# Altium project uavDataModule.PrjPcb
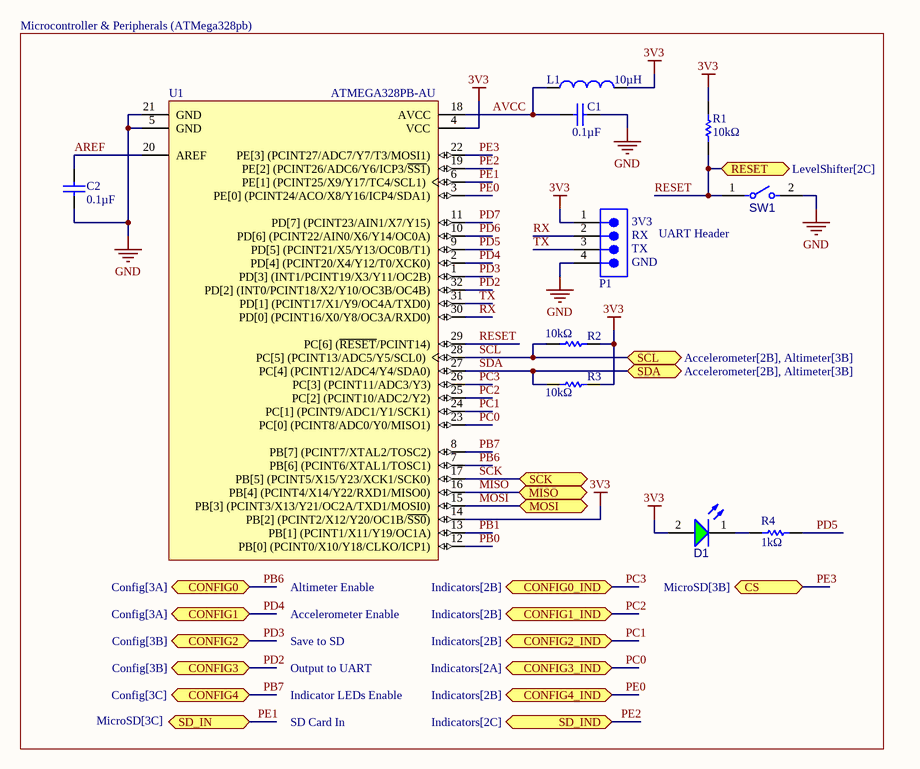
[diagram p0: Microcontroller.SchDoc]
8 sheets, 52 parts. Net scope: flat (ports and power ports of the same name join across sheets).
Board file: Main.PcbDoc
Sheets:
  Microcontroller.SchDoc
  Altimeter.SchDoc
  Accelerometer.SchDoc
  MicroSD.SchDoc
  Power.SchDoc
  LevelShifter.SchDoc
  Config.SchDoc
  Indicators.SchDoc

## Sheet Microcontroller.SchDoc
size A; SheetNumber: 1; SheetTotal: 8

### Parts
C1  0.1µF  [CAPC3216X100X50LL20T25]
C2  0.1µF  [CAPC3216X100X50LL20T25]
D1  150120GS75000  [WL-SMCW_1206_150120xx75000]  (value not drawn)
L1  10µH  [WE-MI_1206_L3.2W1.6H1.1]
P1  61300411121  [61300411121]  (value not drawn)
R1  10kΩ  [RESC3116X65X40LL10T20]
R2  10kΩ  [RESC3116X65X40LL10T20]
R3  10kΩ  [RESC3116X65X40LL10T20]
R4  1kΩ  [RESC3116X65X40LL10T20]
SW1  RST  [FP-B3U-1000P-B-MFG]  (value not drawn)
U1  ATMEGA328PB-AU  [ATML-32A_L]

### Ports
CONFIG0 (bidir, see Config[3A]), CONFIG0_IND (bidir, see Indicators[2B]), CONFIG1 (bidir, see Config[3A]), CONFIG1_IND (bidir, see Indicators[2B]), CONFIG2 (bidir, see Config[3B]), CONFIG2_IND (bidir, see Indicators[2B]), CONFIG3 (bidir, see Config[3B]), CONFIG3_IND (bidir, see Indicators[2A]), CONFIG4 (bidir, see Config[3C]), CONFIG4_IND (bidir, see Indicators[2B]), CS (bidir, see MicroSD[3B]), MISO (bidir, see LevelShifter[4C], MicroSD[3B]), MOSI (bidir, see LevelShifter[2B], MicroSD[3B]), RESET (bidir, see LevelShifter[2C]), SCK (bidir, see LevelShifter[2C], MicroSD[3B]), SCL (bidir, see Accelerometer[2B], Altimeter[3B]), SD_IN (bidir, see MicroSD[3C]), SD_IND (bidir, see Indicators[2C]), SDA (bidir, see Accelerometer[2B], Altimeter[3B])

### Nets
3V3: D1.2(A) L1.2 P1.1 R1.2 R2.2 R3.2 U1.4(VCC) U1.14(PB[2]_(PCINT2/X12/Y20/OC1B/~{SS0}))
GND: C1.1 C2.2 P1.4 SW1.2 U1.5(GND) U1.21(GND)
AREF: C2.1 U1.20(AREF)
AVCC: C1.2 L1.1 U1.18(AVCC)
MISO: U1.16(PB[4]_(PCINT4/X14/Y22/RXD1/MISO0)) ; port MISO
MOSI: U1.15(PB[3]_(PCINT3/X13/Y21/OC2A/TXD1/MOSI0)) ; port MOSI
PB0: U1.12(PB[0]_(PCINT0/X10/Y18/CLKO/ICP1))
PB1: U1.13(PB[1]_(PCINT1/X11/Y19/OC1A))
PB6: U1.7(PB[6]_(PCINT6/XTAL1/TOSC1)) ; port CONFIG0
PB7: U1.8(PB[7]_(PCINT7/XTAL2/TOSC2)) ; port CONFIG4
PC0: U1.23(PC[0]_(PCINT8/ADC0/Y0/MISO1)) ; port CONFIG3_IND
PC1: U1.24(PC[1]_(PCINT9/ADC1/Y1/SCK1)) ; port CONFIG2_IND
PC2: U1.25(PC[2]_(PCINT10/ADC2/Y2)) ; port CONFIG1_IND
PC3: U1.26(PC[3]_(PCINT11/ADC3/Y3)) ; port CONFIG0_IND
PD2: U1.32(PD[2]_(INT0/PCINT18/X2/Y10/OC3B/OC4B)) ; port CONFIG3
PD3: U1.1(PD[3]_(INT1/PCINT19/X3/Y11/OC2B)) ; port CONFIG2
PD4: U1.2(PD[4]_(PCINT20/X4/Y12/T0/XCK0)) ; port CONFIG1
PD5: R4.1 U1.9(PD[5]_(PCINT21/X5/Y13/OC0B/T1))
PD6: U1.10(PD[6]_(PCINT22/AIN0/X6/Y14/OC0A))
PD7: U1.11(PD[7]_(PCINT23/AIN1/X7/Y15))
PE0: U1.3(PE[0]_(PCINT24/ACO/X8/Y16/ICP4/SDA1)) ; port CONFIG4_IND
PE1: U1.6(PE[1]_(PCINT25/X9/Y17/TC4/SCL1)) ; port SD_IN
PE2: U1.19(PE[2]_(PCINT26/ADC6/Y6/ICP3/~{SS1})) ; port SD_IND
PE3: U1.22(PE[3]_(PCINT27/ADC7/Y7/T3/MOSI1)) ; port CS
RESET: R1.1 SW1.1 U1.29(PC[6]_(~{RESET}/PCINT14)) ; port RESET
RX: P1.2 U1.30(PD[0]_(PCINT16/X0/Y8/OC3A/RXD0))
SCK: U1.17(PB[5]_(PCINT5/X15/Y23/XCK1/SCK0)) ; port SCK
SCL: R2.1 U1.28(PC[5]_(PCINT13/ADC5/Y5/SCL0)) ; port SCL
SDA: R3.1 U1.27(PC[4]_(PCINT12/ADC4/Y4/SDA0)) ; port SDA
TX: P1.3 U1.31(PD[1]_(PCINT17/X1/Y9/OC4A/TXD0))
NetD1_1: D1.1(K) R4.2

### Notes on the sheet
- Microcontroller & Peripherals (ATMega328pb)
- (near P1) 3V3
- (near P1) TX
- (near P1) RX
- (near P1) GND
- UART Header
- (near U1) Altimeter Enable
- Accelerometer Enable
- Save to SD
- Output to UART
- Indicator LEDs Enable
- SD Card In

### Library data of the parts
C1 C2 = CMP-1664-00001-4: Chip Capacitor, 100 nF, +/- 10%, 25 V, -55 to 125 degC, 1206 (3216 Metric), RoHS, Tape and Reel; Manufacturer: Kemet; Voltage Rating: 25 V; ComponentLink1URL: http://www.kemet.com/; Max Operating Temperature: 125 degC; PackageReference: 1206; ComponentLink2URL: http://www.kemet.com/docfinder?Partnumber=C1206F104K3RACTU; ComponentLink1Description: Manufacturer URL; ComponentLink2Description: Datasheet; Length: 3.2 mm; Packaging: Tape and Reel; Height: 0.78 mm; Mounting Technology: Surface Mount; REACH SVHC: No SVHC; PackageDescription: 2-Pin Surface Mount Device, Body 3.2 x 1.6 mm; Min Operating Temperature: -55 degC; RoHSCompliant: true; DatasheetVersion: 02/2016; Package Quantity: 4000
D1 = CMP-1426-00014-4: WL-SMCW SMT Mono-Color Chip LED Waterclear; Dominant Wavelength: 525nm; Reverse Voltage: 5V; Max Junction Temperature (Tj): 95°C; Lens Style: Clear, Rectangular; Forward Voltage: 3.2V; Power Dissipation: 105mW; Peak Wavelength: 515nm; Test Current: 20mA; Color: Green; Forward Current: 100mA; Luminous Intensity: 450mcd; Viewing Angle: 140°; Case Code (Imperial): 1206; REACH SVHC: Unknown; Packaging: Tape and Reel; Max Operating Temperature: 85°C; Case/Package: 1206; Height: 680µm; Length: 3.2mm; Mount: Surface Mount; Min Operating Temperature: -40°C; Width: 1.6mm; Case Code (Metric): 3216; Max Reverse Voltage (DC): 5V; RoHS: Compliant; Wavelength: 525nm
L1 = CMP-0221-00030-2: NexarPartId: 23259292; Max DC Current: 25mA; Inductance Tolerance: 10%; Core Material: Ferrite; Shielding: Unshielded; DC Resistance (DCR): 500mΩ; Self Resonant Frequency: 26MHz; Ambient Temperature Range Low: -55°C; RoHS: Compliant; Inductance: 10µH; Tolerance: 10%; Length: 3.2mm; Width: 1.6mm; Case/Package: SMD/SMT; Min Operating Temperature: -55°C; Ambient Temperature Range High: 85°C; Depth: 1.6mm; Current Rating: 25mA; Max Operating Temperature: 125°C; Height: 1.1mm
P1 = 61300411121: WR-PHD Pin Header, THT, Vertical, pitch 2.54mm, 1 Row, 4P; Manufacturer: Wurth Elektronik; Contact Resistance: 20mOhm; Rated Current: 3A; Working Voltage: 250V; Withstanding Voltage: 500V; Manufacturer Part Number: 61300411121; Category: Board-to-Board Connectors; Match Code: WR-PHD; ComponentLink1Description: Website Link; ComponentLink1URL: https://www.we-online.com/redexpert/article/61300411121?ad; ComponentLink2Description: Datasheet Link; ComponentLink2URL: https://www.we-online.com/redexpert/spec/61300411121?ad; Mount: Through Hole; Operating Temperature Max: 105°C; Operating Temperature Min: -40°C; Packaging: Bag; Gender: Pin Header; Number of Pins: 4; Number of Rows: 1; Orientation: Vertical; Pitch: 2.54mm
R1-R3 = CMP-1014-00623-2: Chip Resistor, 10 KOhm, +/- 1%, 0.25 W, -55 to 155 degC, 1206 (3216 Metric), RoHS, Tape and Reel; Manufacturer: Yageo; Voltage Rating: 200V; Resistance: 10KOhm; Temperature Coefficient: 100ppm/degreesC; Power Rating: 250mW; Packaging: TapeandReel; Termination: SMD/SMT; REACH SVHC: Unknown; Tolerance: 1%; Height: 0.55mm; Composition: ThickFilm; Max Operating Temperature: 155degC; Datasheet Version: Rev. 5, 10/2016; Lead Free: LeadFree; Case Code (Metric): 3216; Depth: 1.6mm; Package Quantity: 5000; RoHSCompliant: true; Military Standard: Not; Case/Package: 1206; Case Code (Imperial): 1206; Min Operating Temperature: -55degC; Datasheet URL: http://www.yageo.com/NewPortal/yageodocoutput?fileName=/pdf/R-Chip/PYu-RC_Group_51_RoHS_L_5.pdf; Length: 3.1mm; Manufacturer URL: http://www.yageo.com/; Package Reference: 1206.0; Width: 1.6mm; Package Description: 2-Pin Surface Mount Device, Body 3.1 x 1.6 mm
R4 = CMP-2100-03678-1: Chip Resistor, 1 KOhm, +/- 1%, 0.25 W, -55 to 155 degC, 1206 (3216 Metric), RoHS, Tape and Reel; Manufacturer: Yageo; Temperature Coefficient: 100ppm/degreesC; Power Rating: 250mW; Voltage Rating: 200V; Resistance: 1KOhm; Composition: ThickFilm; Min Operating Temperature: -55degC; Tolerance: 1%; REACH SVHC: Unknown; Case Code (Metric): 3216; Military Standard: Not; Datasheet Version: Rev. 5, 10/2016; Package Reference: 1206.0; Case/Package: 1206; Length: 3.1mm; Manufacturer URL: http://www.yageo.com/; Lead Free: LeadFree; RoHSCompliant: true; Termination: SMD/SMT; Packaging: TapeandReel; Package Description: 2-Pin Surface Mount Device, Body 3.1 x 1.6 mm; Depth: 1.6mm; Case Code (Imperial): 1206; Max Operating Temperature: 155degC; Datasheet URL: http://www.yageo.com/NewPortal/yageodocoutput?fileName=/pdf/R-Chip/PYu-RC_Group_51_RoHS_L_5.pdf; Height: 0.55mm
SW1 = CMP-08834-000005-1: SWITCH TACTILE SPST-NO 0.05A 12V; Manufacturer Part Number: B3U-1000P-B; Manufacturer: Omron; Operating Force: 1.5N; Contact Current Rating: 50mA; Contact Resistance: 100mΩ; Electromechanical Life: 200000Cycles; Height: 1.75mm; Device Class L2: Switches; Temperature Range High: +70°C; Digikey Description: SWITCH TACTILE SPST-NO 0.05A 12V; Throw Configuration: SPST-NO; Ambient Temperature Range High: +70°C; Temperature: -25°C to +70°C; Lead Free: Yes; ComponentLink2URL: https://omronfs.omron.com/en_US/ecb/products/pdf/en-b3u.pdf; Device Class L3: Tactile Switches; Ambient Temperature Range Low: -25°C; Mount: Surface Mount; Automotive: No; Mouser Description: Tactile Switches Top Actuated with boss w/o ground; Octopart: https://octopart.com/b3u-1000p-b-omron-1057356; RoHS: TRUE; Package: 0; Device Class L1: Electromechanical; Voltage Rating Dc: 12V; Category: Switch; Temperature Range Low: -25°C; ComponentLink2Description: Datasheet
U1 = CMP-2000-07439-1: AVR Microcontroller, 1.8 to 5.5 V, 32 KB Flash, 1 KB EEPROM, 2 KB SRAM, -40 to 85 degC, 32-Pin TQFP (32A), RoHS, Tray; Manufacturer: Microchip; Datasheet URL: http://ww1.microchip.com/downloads/en/DeviceDoc/40001906A.pdf; Mounting Technology: SurfaceMount; RoHSCompliant: false; Manufacturer URL: http://www.microchip.com/; Package Description: 32-Pin Thin Profile Plastic Quad Flat Package, Body 7 x 7 mm, Pitch 0.8 mm; Package Reference: 32A; Datasheet Version: Rev. A, 04/2017

## Sheet Altimeter.SchDoc
size A; SheetNumber: 2; SheetTotal: 8
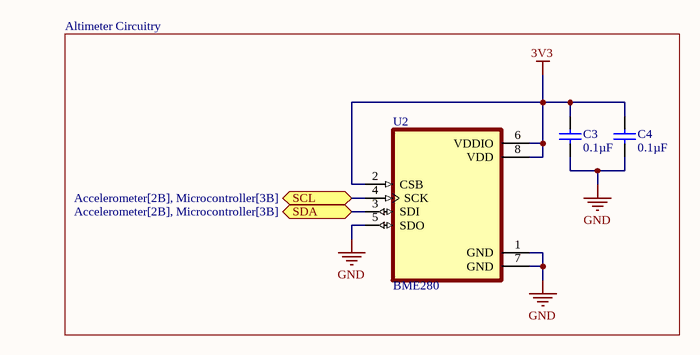
[diagram p1: Altimeter.SchDoc]

### Parts
C3  0.1µF  [CAPC3216X100X50LL20T25]
C4  0.1µF  [CAPC3216X100X50LL20T25]
U2  BME280  [PSON65P250X250X100-8N]

### Blocks framed on the sheet
Altimeter Circuitry: C3 C4 U2

### Ports
SCL (bidir, see Accelerometer[2B], Microcontroller[3B]), SDA (bidir, see Accelerometer[2B], Microcontroller[3B])

### Nets
3V3: C3.1 C4.1 U2.2(CSB) U2.6(VDDIO) U2.8(VDD)
GND: C3.2 C4.2 U2.1(GND) U2.5(SDO) U2.7(GND)
SCL: U2.4(SCK) ; port SCL
SDA: U2.3(SDI) ; port SDA

### Library data of the parts
C3 C4 = CMP-1664-00001-4: as C1 on sheet Microcontroller; ComponentLink1URL: http://www.kemet.com/; Max Operating Temperature: 125 degC; PackageReference: 1206; ComponentLink2URL: http://www.kemet.com/docfinder?Partnumber=C1206F104K3RACTU; ComponentLink1Description: Manufacturer URL; ComponentLink2Description: Datasheet; Length: 3.2 mm; Packaging: Tape and Reel; Height: 0.78 mm; Mounting Technology: Surface Mount; REACH SVHC: No SVHC; PackageDescription: 2-Pin Surface Mount Device, Body 3.2 x 1.6 mm; Min Operating Temperature: -55 degC; RoHSCompliant: true; DatasheetVersion: 02/2016; Package Quantity: 4000
U2 = BME280: DIGITAL HUMIDITY, PRESSURE AND TEMPERATURE SENSOR<br>* Digital interface IÂ²C (up to 3.4 MHz) and SPI (3 and 4 wire, up to 10 MHz)* Supply voltage VDD main supply voltage range: 1.71 V to 3.6 V*VDDIO interface voltage range: 1.2 V to 3.6 V<br> Operating range -40â€¦+85 Â°C, 0â€¦100 % rel. humidity, 300â€¦1100 hPa <br><br>  The library has been designed by<a href="https://www.facebook.com/groups/eaglecadsoftUK"> Richard Magdycz</a>; Package: None; Availability: Unavailable; MP: BME280; Value: *; Price: None

## Sheet Accelerometer.SchDoc
size A; SheetNumber: 3; SheetTotal: 8
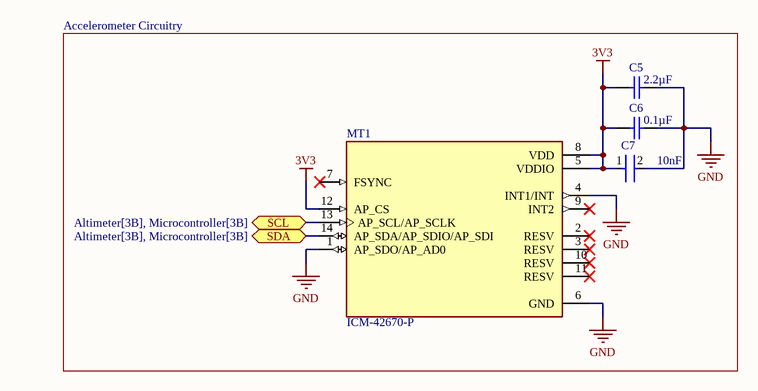
[diagram p2: Accelerometer.SchDoc]

### Parts
C5  2.2µF  [CAPC3216X180X50LL20T25]
C6  0.1µF  [CAPC3216X100X50LL20T25]
C7  10nF  [FP-C1206C-EB-MFG]
MT1  ICM-42670-P  [XDCR_ICM-42670-P]

### Blocks framed on the sheet
Accelerometer Circuitry: C5-C7 MT1

### Ports
SCL (bidir, see Altimeter[3B], Microcontroller[3B]), SDA (bidir, see Altimeter[3B], Microcontroller[3B])

### Nets
3V3: C5.2 C6.2 C7.1 MT1.5(VDDIO) MT1.8(VDD) MT1.12(AP_CS)
GND: C5.1 C6.1 C7.2 MT1.1(AP_SDO/AP_AD0) MT1.4(INT1/INT) MT1.6(GND)
SCL: MT1.13(AP_SCL/AP_SCLK) ; port SCL
SDA: MT1.14(AP_SDA/AP_SDIO/AP_SDI) ; port SDA

Not connected (* = marked no-connect by the designer): MT1 2(RESV)* 3(RESV)* 7(FSYNC)* 9(INT2)* 10(RESV)* 11(RESV)*

### Library data of the parts
C5 = CMP-1037-04831-2: Chip Capacitor, 2.2 uF, +/- 10%, 50 V, -55 to 125 degC, 1206 (3216 Metric), RoHS, Tape and Reel; Manufacturer: Kemet; Case Width: 1.6mm; Capacitance - nF: 2200nF; Capacitance: 2.2uF; Class: Class1; Type: SMDMLCCX7R6.3-250VDCCommericalGrade; Voltage Rating: 50V; Case Length: 3.2mm; Dielectric: X7R; Temperature Coefficient / Code: +/-15%; Product Category: MultilayerCeramicCapacitorsMLCC-SMD/SMT; Package Description: 2-Pin Surface Mount Device, Body 3.2 x 1.6 mm; Minimum Operating Temperature: -55C; RoHS: Details; Package / Case: 1206(3216metric); Packaging: Reel; Case Code - mm: 3216; Datasheet Version: 02/2016; Tolerance: 10%; Series: C1206C; Dimensions: 1.6mmWx3.2mmLx1.6mmH; Case Height: 1.6mm; Brand: Kemet; Mounting Technology: SurfaceMount; Manufacturer URL: http://www.kemet.com/; Voltage Rating DC: 50V; Datasheet URL: http://www.kemet.com/docfinder?Partnumber=C1206C225K5RACTU; Maximum Operating Temperature: +125C; Case Code - in: 1206; Package Reference: 1206; Termination Style: SMD/SMT; Operating Temperature Range: -55Cto+125C; Product: GeneralTypeMLCCs; Factory Pack Quantity: 2000
C6 = CMP-1664-00001-4: as C1 on sheet Microcontroller; ComponentLink1URL: http://www.kemet.com/; Max Operating Temperature: 125 degC; PackageReference: 1206; ComponentLink2URL: http://www.kemet.com/docfinder?Partnumber=C1206F104K3RACTU; ComponentLink1Description: Manufacturer URL; ComponentLink2Description: Datasheet; Length: 3.2 mm; Packaging: Tape and Reel; Height: 0.78 mm; Mounting Technology: Surface Mount; REACH SVHC: No SVHC; PackageDescription: 2-Pin Surface Mount Device, Body 3.2 x 1.6 mm; Min Operating Temperature: -55 degC; RoHSCompliant: true; DatasheetVersion: 02/2016; Package Quantity: 4000
C7 = CMP-03020-003656-1: CAP CER 10000PF 100V X7R 1206; Manufacturer: KEMET; Manufacturer Part Number: C1206C103J1RACTU; Temperature Coefficient: 15%; Capacitance: 10,000 pF; Automotive Grade: Grade 0; Value: 10,000 pF; Material: Ceramic; Tolerance: 0.05; Digikey Description: CAP CER 10000PF 100V X7R 1206; Temperature Range Low: -55°C; Height: 0.88mm; Automotive: Yes; Ipc Land Pattern Name: CAPC320160X78; ComponentLink2URL: https://content.kemet.com/datasheets/KEM_C1007_X8R_ULTRA_150C_SMD.pdf; Device Class L2: Capacitors; Mouser Description: 1206 C 10nF Ceramic Multilayer Capacitor, 100 VDC, +125degC, X7R Dielec, +/-5%; Octopart: https://octopart.com/c1206c103j1ractu-kemet-121270; Category: Cap; Temperature Characteristic: X7R; Voltage Rating: 100 V; Temperature: -55°C to +150°C; Device Class L1: Passive Components; RoHS: TRUE; Device Class L3: Ceramic Capacitors; Package: C1206C-EB; Lead Free: Yes; ComponentLink2Description: Datasheet; Temperature Range High: +150°C
MT1 = ICM-42670-P: Package: None; Price: None; Value: *; MP: ICM-42670-P; Availability: Unavailable

## Sheet MicroSD.SchDoc
size A; SheetNumber: 4; SheetTotal: 8
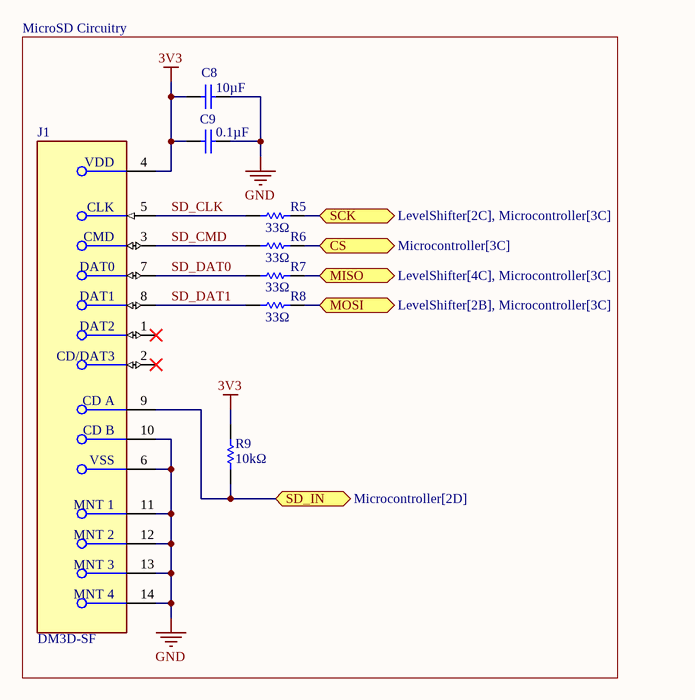
[diagram p3: MicroSD.SchDoc]

### Parts
C8  10µF  [CAPC3216X180X50ML20T25]
C9  0.1µF  [CAPC3216X100X50ML20T25]
J1  DM3D-SF  [FP-DM3D-SF-MFG]
R5  33Ω  [RESC1206(3216)_L]
R6  33Ω  [RESC1206(3216)_L]
R7  33Ω  [RESC1206(3216)_L]
R8  33Ω  [RESC1206(3216)_L]
R9  10kΩ  [RESC3116X65X40LL10T20]

### Blocks framed on the sheet
MicroSD Circuitry: C8 C9 J1 R5-R9

### Ports
CS (bidir, see Microcontroller[3C]), MISO (bidir, see LevelShifter[4C], Microcontroller[3C]), MOSI (bidir, see LevelShifter[2B], Microcontroller[3C]), SCK (bidir, see LevelShifter[2C], Microcontroller[3C]), SD_IN (bidir, see Microcontroller[2D])

### Nets
3V3: C8.2 C9.2 J1.4(VDD) R9.2
GND: C8.1 C9.1 J1.6(VSS) J1.10(CD_B) J1.11(MNT_1) J1.12(MNT_2) J1.13(MNT_3) J1.14(MNT_4)
MISO: R7.2 ; port MISO
MOSI: R8.2 ; port MOSI
PE1: J1.9(CD_A) R9.1 ; port SD_IN
PE3: R6.2 ; port CS
SCK: R5.2 ; port SCK
SD_CLK: J1.5(CLK) R5.1
SD_CMD: J1.3(CMD) R6.1
SD_DAT0: J1.7(DAT0) R7.1
SD_DAT1: J1.8(DAT1) R8.1

Not connected (* = marked no-connect by the designer): J1 1(DAT2)* 2(CD/DAT3)*

### Library data of the parts
C8 = CMP-1664-00006-1: CAP, Ceramic, 10 uF, +/- 10%, 16 V, -55 to 125 degC, 1206 (3216 Metric), RoHS, Tape and Reel; Voltage Rating: 50 V; Case\Package: 0603; Type (Capacitors): C0G; Tolerance: 5%; Capacitance: 8.2 pF; Length: 1.6 mm; Mount: Surface Mount; Radiation Hardening: No; Height: 0.8 mm; RoHSCompliant: true; ComponentLink1URL: http://www.kemet.com/; REACH SVHC: No SVHC; ComponentLink1Description: Manufacturer URL; ComponentLink2Description: Datasheet; ComponentLink2URL: http://capacitoredge.kemet.com/capedge2/DataSheet/Datasheet-C1206C106K4RACTU.pdf?pn=C1206C106K4RACTU; Width: 0.8 mm; Packaging: Tape and Reel; Min Operating Temperature: -55 degC; Voltage Rating (DC): 50 V; Pins: 2; Max Operating Temperature: 125 degC; Case Code (Imperial): 0603; PackageDescription: 2-Pin Surface Mount Device, Body 3.2 x 1.6 mm; DatasheetVersion: Aug-16; Package Quantity: 4000; PackageReference: 1206; Case Code (Metric): 1608
C9 = CMP-1664-00001-4: as C1 on sheet Microcontroller; ComponentLink1URL: http://www.kemet.com/; Max Operating Temperature: 125 degC; PackageReference: 1206; ComponentLink2URL: http://www.kemet.com/docfinder?Partnumber=C1206F104K3RACTU; ComponentLink1Description: Manufacturer URL; ComponentLink2Description: Datasheet; Length: 3.2 mm; Packaging: Tape and Reel; Height: 0.78 mm; Mounting Technology: Surface Mount; REACH SVHC: No SVHC; PackageDescription: 2-Pin Surface Mount Device, Body 3.2 x 1.6 mm; Min Operating Temperature: -55 degC; RoHSCompliant: true; DatasheetVersion: 02/2016; Package Quantity: 4000
J1 = CMP-2000-06166-2: CONN MICRO SD CARD PUSH-PULL; Insulation Resistance: 1GR; Max Voltage Rating (AC): 125V; Gender: Female; Contact Resistance: 100mR; Current Rating: 500mA; Pitch: 1.1mm; Connector Type: Connector; Number of Contacts: 8; Contact Plating: Gold; Number of Rows: 1; Termination: Solder; Contact Material: Copper Alloy; REACH SVHC: No SVHC; Voltage Rating (AC): 125V; Packaging: Tape and Reel; Housing Material: Polymer; Max Operating Temperature: 85°C; Package Quantity: 1; Min Operating Temperature: -25°C; Lead Free: Lead Free; Orientation: Right Angle; Radiation Hardening: No; Flammability Rating: UL94 V-0; Mount: Surface Mount; Depth: 11.45mm; Max Current Rating: 500mA; Length: 11.95mm; Width: 11.95mm
R5-R8 = CMP-1014-00341-1: 33R 0.25W 1% 1206 (3216 Metric)  SMD; Case-EIA: 1206; Value: 33.00 Ohm; Case-Metric: 3216; Tolerance: 1 %; Technology: SMT; Power: 0.25 W
R9 = CMP-1014-00623-2: as R1 on sheet Microcontroller; Packaging: TapeandReel; Termination: SMD/SMT; REACH SVHC: Unknown; Tolerance: 1%; Height: 0.55mm; Composition: ThickFilm; Max Operating Temperature: 155degC; Datasheet Version: Rev. 5, 10/2016; Lead Free: LeadFree; Case Code (Metric): 3216; Depth: 1.6mm; Package Quantity: 5000; RoHSCompliant: true; Military Standard: Not; Case/Package: 1206; Case Code (Imperial): 1206; Min Operating Temperature: -55degC; Datasheet URL: http://www.yageo.com/NewPortal/yageodocoutput?fileName=/pdf/R-Chip/PYu-RC_Group_51_RoHS_L_5.pdf; Length: 3.1mm; Manufacturer URL: http://www.yageo.com/; Package Reference: 1206.0; Width: 1.6mm; Package Description: 2-Pin Surface Mount Device, Body 3.1 x 1.6 mm

## Sheet Power.SchDoc
size A; SheetNumber: 5; SheetTotal: 8
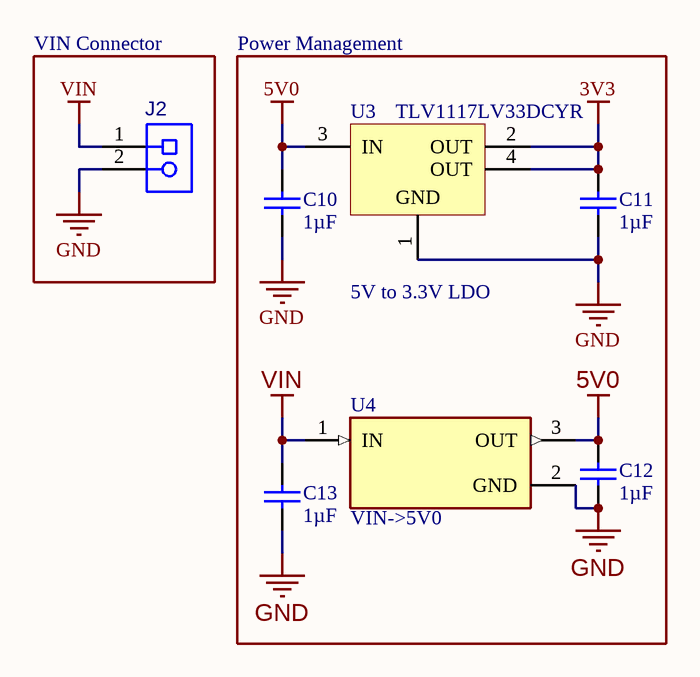
[diagram p4: Power.SchDoc]

### Parts
C10  1µF  [CAPC3216X110X50LL20T25]
C11  1µF  [CAPC3216X110X50LL20T25]
C12  1µF  [CAPC3216X110X50LL20T25]
C13  1µF  [CAPC3216X110X50LL20T25]
J2  1729128  [PHOE-1729128-2_V]  (value not drawn)
U3  TLV1117LV33DCYR  [DCY0004A_N]
U4  VIN->5V0  [DPAK229P990X238-4N]

### Blocks framed on the sheet
VIN Connector: J2

### Nets
3V3: C11.2 U3.2(OUT) U3.4(OUT)
5V0: C10.2 C12.2 U3.3(IN) U4.3(OUT)
GND: C10.1 C11.1 C12.1 C13.1 J2.2 U3.1(GND) U4.2(GND)
VIN: C13.2 J2.1 U4.1(IN)

### Notes on the sheet
- Power Management
- 5V to 3.3V LDO

### Library data of the parts
C10-C13 = CMP-2000-06011-1: Chip Capacitor, 1 uF, +/- 10%, 50 V, -55 to 125 degC, 1206 (3216 Metric), RoHS, Tape and Reel; Manufacturer: Kemet; Case Height: 1mm; Dielectric: X7R; Voltage Rating: 50V; Capacitance: 1uF; Temperature Coefficient / Code: +/-15%; Case Length: 3.2mm; Case Width: 1.6mm; Type: SMDMLCCX7R6.3-250VDCCommericalGrade; Class: Class1; Capacitance - nF: 1000nF; Datasheet URL: http://www.kemet.com/docfinder?Partnumber=C1206C105K5RACTU; Product Category: MultilayerCeramicCapacitorsMLCC-SMD/SMT; Termination Style: SMD/SMT; Dimensions: 1.6mmWx3.2mmLx1mmH; Voltage Rating DC: 50V; Datasheet Version: 02/2016; Packaging: Reel; Brand: Kemet; RoHS: Details; Minimum Operating Temperature: -55C; Operating Temperature Range: -55Cto+125C; Package Reference: 1206; Manufacturer URL: http://www.kemet.com/; Product: GeneralTypeMLCCs; Tolerance: 10%; Package Description: 2-Pin Surface Mount Device, Body 3.2 x 1.6 mm; Mounting Technology: SurfaceMount; Case Code - mm: 3216; Maximum Operating Temperature: +125C; Series: C1206C; Factory Pack Quantity: 2500; Package / Case: 1206(3216metric); Case Code - in: 1206
J2 = CMP-2000-05815-1: PCB Terminal Block, 13.5 A, 400 V, 2-Pin THD, RoHS, Bulk; Manufacturer: Phoenix Contact; Package Version: 03/2015; No. of Rows: 1; Pitch: 5.08mm; No. of Positions: 2; Voltage Rating: 400V; Current Rating: 13500mA; Manufacturer URL: http://www.phoenixcontact.com/; Datasheet URL: https://datasheet.ciiva.com/16046/1729128-16046181.pdf; RoHS: TRUE; Package URL: https://www.phoenixcontact.com/online/portal/pi/pxc/product_detail_page/!ut/p/b1/3VdJjqNKFDxLH8AFycySyWY2ozFsEPOMMQaDOX1XedGL_1Vdm5YXJleknhSKeBkvI6EA8ncAo3AYoDhBQGco6KN7VURTdemj9us_IEKEZo_YHiPAEWEFmDGOHMORkqKYCORBZxgL7ZoaZYcbFFUZ3fqxSY6GOuxydWUuHqz1ynmMFygu583Bob0Ewr6Sd_l-5m-kAueHiB0jpRwZwe58wwtkpxtMYd_LmGcDRU02dRNEyWt6Y2ti5pSyJ_reIkzIulrqApdnbT11V5jnCKbYNCvhEM1MCpPByat_X379-iThf08CI5GfOPqfBeS3BRoBOdD55AKVv0iLwCMq-2BrzXWSGRH7pUGD9uwXQjiph3xL0DKQwdGa0JImiIOmBNOestqgwTHSSs2oOep-78apyXQBvNi8ZLaFjvjWvcaUEBu0MC6Wbe-d6mB0FAebo2lUWinqYaZs5DAYzV0RP9yitUjnGJ0iI9xhZkT42OCQNUJJhkgWINNQLP2JFP6OpMg3JCVg70jqHT0lvKOnhHf0lPuOnnLf0VPuWx6_dxwUIvwk5WMkT0kLL1mh61l2yZVSzG3pYV_bqo-mj6uMKwKwdnnW8Jh5RTOJzMOA5c-eJDaZQw4mTMPH02PvS_ZAqNVjVTo2WyYLkwH_KU1mmmG5kjRhDqPXLwwVHvVOjCM60-fpXvTDfMGW1PVFVS1r4e4yVDk4ZdNbkUHvqPqQSeian4UD39fNKmachqdJ1NJbyk8rXT9mXTvPk3oE5meulKGgiruPJek-4I9hTT6G8ZLOyRSm2RRVbThERQad5OS28hdt4YW4vG0stgYYzsWsK4_7y6DZMjJSCqri1kyiZR5vD7pwIrNR7QwPHTcLTI5qT7eRlpHrdGiupYlqQDJ7zy_CND8fWWBoLRXxk1RVcXiBQwbTD4Xi7KL-FuO94t9xaqweXzH; PartNumber: 1729128; Package Description: 2-Pin Through Hole Device, Body 8.1 x 10.16 mm, Pitch 5.08 mm; Datasheet Version: 12/2013; Mounting Technology: ThroughHole; Orientation: Horizontal; Package Reference: 1729128-2; Packing: Bulk
U3 = CMP-0395-00503-2: Single Output LDO, 1 A, Fixed 3.3 V Output, 2 to 5.5 V Input, 4-pin SOT-223 (DCY), -40 to 125 degC, Green (RoHS & no Sb/Br); Manufacturer: Texas Instruments; Vout Adj(Min)(V): 3.3; Vdo(Typ)(mV): 1200; Iq(Typ)(mA): 0.05; Accuracy(%): 2; Iout(Max)(A): 1; SubFamily: Single Channel LDO; Vin(Max)(V): 5.5; PackageReference: DCY0004A; PackageDescription: 4-Pin Plastic Small Outline, Body 3.5 x 6.5 mm, Pitch 2.3 mm; Vout Adj(Max)(V): 3.3; Mounting Technology: Surface Mount; ComponentLink2Description: Datasheet; ComponentLink1Description: Manufacturer URL; PartNumber: TLV1117LV33DCYR; ComponentLink3Description: Package Specification; ComponentLink1URL: http://www.ti.com/; ComponentLink2URL: http://www.ti.com/general/docs/lit/getliterature.tsp?genericPartNumber=TLV1117LV33&fileType=pdf; Fixed Output Options(V): 3.3; PackageVersion: 4202506/B; Vin(Min)(V): 2; DatasheetVersion: SBVS160A; Eco-Plan: Green (RoHS & no Sb/Br); ComponentLink3URL: http://www.ti.com/litv/pdf/mpds094a; Code_JEDEC: TO-261
U4 = MC7805BDTRKG: Linear Voltage Regulator IC 1 Output 1A DPAK; MF: ON Semiconductor; MP: MC7805BDTRKG; Package: TO-252-3 Freescale Semiconductor; Price: None; Availability: Unavailable; Value: *; SnapEDA_Link: https://www.snapeda.com/parts/MC7805BDTRKG/ON%20Semiconductor/view-part/360207/?ref=snap

## Sheet LevelShifter.SchDoc
size A; SheetNumber: 6; SheetTotal: 8
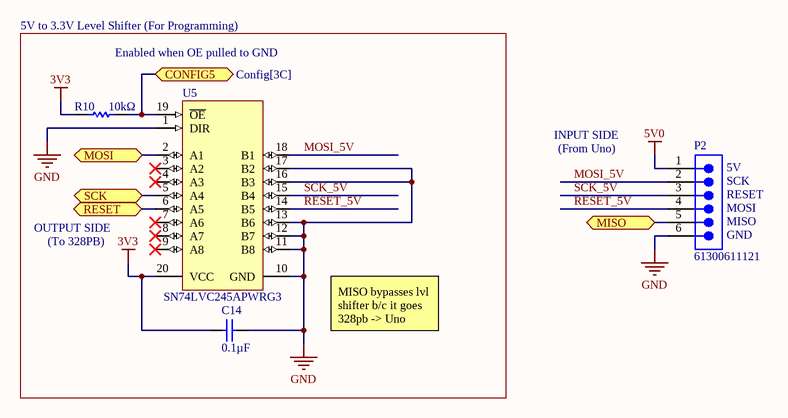
[diagram p5: LevelShifter.SchDoc]

### Parts
C14  0.1µF  [CAPC3216X100X50LL20T25]
P2  61300611121  [61300611121]
R10  10kΩ  [RESC3116X65X40LL10T20]
U5  SN74LVC245APWRG3  [PW0020A_N]

### Ports
CONFIG5 (bidir, see Config[3C]), MISO (bidir, see Microcontroller[3C], MicroSD[3B]), MOSI (bidir, see Microcontroller[3C], MicroSD[3B]), RESET (bidir, see Microcontroller[3B]), SCK (bidir, see Microcontroller[3C], MicroSD[3B])

### Nets
3V3: C14.1 R10.2 U5.20(VCC)
5V0: P2.1
GND: C14.2 P2.6 U5.1(DIR) U5.10(GND) U5.11(B8) U5.12(B7) U5.13(B6) U5.16(B3) U5.17(B2)
MISO: P2.5 ; port MISO
MOSI: U5.2(A1) ; port MOSI
MOSI_5V: P2.2 U5.18(B1)
RESET: U5.6(A5) ; port RESET
RESET_5V: P2.4 U5.14(B5)
SCK: U5.5(A4) ; port SCK
SCK_5V: P2.3 U5.15(B4)
NetR10_1: R10.1 U5.19(~{OE}) ; port CONFIG5

Not connected (* = marked no-connect by the designer): U5 3(A2)* 4(A3)* 7(A6)* 8(A7)* 9(A8)*

### Notes on the sheet
- 5V to 3.3V Level Shifter (For Programming)
- Enabled when OE pulled to GND
- INPUT SIDE
- (From Uno)
- (near P2) 5V
- (near P2) SCK
- OUTPUT SIDE
- (To 328PB)
- (near P2) MISO
- (near P2) GND
- (near P2) MOSI
- (near P2) RESET
- MISO bypasses lvl shifter b/c it goes 328pb -> Uno

### Library data of the parts
C14 = CMP-1664-00001-4: as C1 on sheet Microcontroller; ComponentLink1URL: http://www.kemet.com/; Max Operating Temperature: 125 degC; PackageReference: 1206; ComponentLink2URL: http://www.kemet.com/docfinder?Partnumber=C1206F104K3RACTU; ComponentLink1Description: Manufacturer URL; ComponentLink2Description: Datasheet; Length: 3.2 mm; Packaging: Tape and Reel; Height: 0.78 mm; Mounting Technology: Surface Mount; REACH SVHC: No SVHC; PackageDescription: 2-Pin Surface Mount Device, Body 3.2 x 1.6 mm; Min Operating Temperature: -55 degC; RoHSCompliant: true; DatasheetVersion: 02/2016; Package Quantity: 4000
P2 = CMP-1502-01070-3: NexarPartId: 20084590; Current Rating: 3A; Pitch: 2.54mm; Gender: Male; Operating Supply Voltage: 250V; Connector Type: Male Pin; Number of Positions: 6; Contact Resistance: 20mΩ; Packaging: Bulk; Number of Pins: 6; Number of Rows: 1; Contact Plating: Gold; Lead Free: Lead Free; RoHS: Compliant; Contact Mating Length: 5.9944mm; Voltage Rating: 250V; REACH SVHC: Unknown; Contact Gender: Male; Housing Material: PBT; Min Operating Temperature: -40°C; Lead Pitch: 2.54mm; Mount: Through Hole; Number of Contacts: 6; Max Operating Temperature: 105°C; Contact Material: Copper; Orientation: Vertical; Termination: Through Hole; Color: Black; Height: 8.89mm
R10 = CMP-1014-00623-2: as R1 on sheet Microcontroller; Packaging: TapeandReel; Termination: SMD/SMT; REACH SVHC: Unknown; Tolerance: 1%; Height: 0.55mm; Composition: ThickFilm; Max Operating Temperature: 155degC; Datasheet Version: Rev. 5, 10/2016; Lead Free: LeadFree; Case Code (Metric): 3216; Depth: 1.6mm; Package Quantity: 5000; RoHSCompliant: true; Military Standard: Not; Case/Package: 1206; Case Code (Imperial): 1206; Min Operating Temperature: -55degC; Datasheet URL: http://www.yageo.com/NewPortal/yageodocoutput?fileName=/pdf/R-Chip/PYu-RC_Group_51_RoHS_L_5.pdf; Length: 3.1mm; Manufacturer URL: http://www.yageo.com/; Package Reference: 1206.0; Width: 1.6mm; Package Description: 2-Pin Surface Mount Device, Body 3.1 x 1.6 mm
U5 = CMP-1620-00520-2: Octal Bus Transceiver With 3-State Outputs, PW0020A, LARGE T&R; Manufacturer: Texas Instruments; Input Type: TTL/CMOS; tpd @ Nom Voltage(Max)(ns): 12.7,8.3,7.3,6.3; Output Type: LVTTL; Bits(#): 8; VCC(Max)(V): 3.6; F @ Nom Voltage(Max)(Mhz): 100; Output Drive (IOL/IOH)(Max)(mA): -24/24; Rating: Catalog; Schmitt Trigger: No; ICC @ Nom Voltage(Max)(mA): 0.03; VCC(Min)(V): 1.65; Voltage(Nom)(V): 1.8,2.5,2.7,3.3; Technology Family: LVC; DatasheetVersion: SCAS218X; PackageReference: PW0020A; Generic Part Number: SN74LVC245A; Code_JEDEC: MO-153; Operating Temperature Range(C): -40 to 125

## Sheet Config.SchDoc: Config
size 127 x 127 mm; SheetNumber: 7; SheetTotal: 8
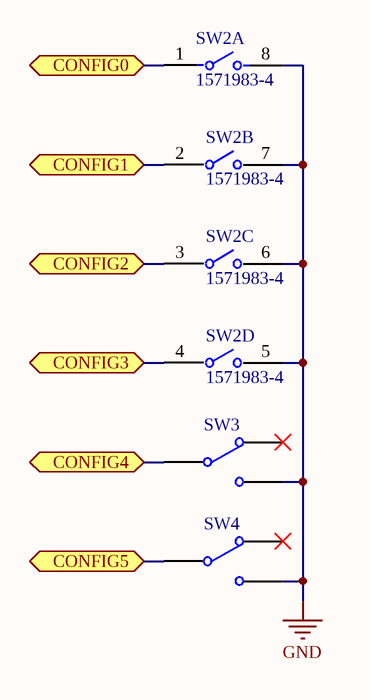
[diagram p6: Config.SchDoc]

### Parts
SW2  1571983-4  [FP-1571983-4-MFG]  (parts A,B,C,D of 4)
SW3  450404015514  [450404015514]  (value not drawn)
SW4  450404015514  [450404015514]  (value not drawn)

### Ports
CONFIG0 (bidir, see Microcontroller[2C]), CONFIG1 (bidir, see Microcontroller[2C]), CONFIG2 (bidir, see Microcontroller[2C]), CONFIG3 (bidir, see Microcontroller[2D]), CONFIG4 (bidir, see Microcontroller[2D]), CONFIG5 (bidir, see LevelShifter[2B])

### Nets
GND: SW2.5 SW2.6 SW2.7 SW2.8 SW3.L2 SW4.L2
PB6: SW2.1 ; port CONFIG0
PB7: SW3.COM ; port CONFIG4
PD2: SW2.4 ; port CONFIG3
PD3: SW2.3 ; port CONFIG2
PD4: SW2.2 ; port CONFIG1
NetR10_1: SW4.COM ; port CONFIG5

Not connected (* = marked no-connect by the designer): SW3 L1*; SW4 L1*

### Library data of the parts
SW2 = CMP-03400-000014-1: SWITCH SLIDE DIP SPST 25MA 24V; Manufacturer: TE Connectivity; Standoff Height: 0.1mm; Electromechanical Life: 1000Cycles; Number Of Circuits: 4; Contact Resistance: 100mΩ; ComponentLink2URL: https://www.te.com/commerce/DocumentDelivery/DDEController?Action=showdoc&DocId=Customer+Drawing%7F1571983%7FC6%7Fpdf%7FEnglish%7FENG_CD_1571983_C6.pdf%7F1571983-4; Throw Configuration: SPST; Device Class L1: Electromechanical; Lead Free: Yes; Temperature Range Low: -30°C; Temperature: -30°C to +85°C; Octopart: https://octopart.com/1571983-4-te+connectivity-46507521; Temperature Range High: +85°C; Package: 1571983-4; Height: 2.56mm; Manufacturer Part Number: 1571983-4; Contact Current Rating: 25mA; ComponentLink2Description: Datasheet; Device Class L3: DIP Switches; Category: Switch; Device Class L2: Switches; RoHS: TRUE; Voltage Rating Dc: 24V; Digikey Description: SWITCH SLIDE DIP SPST 25MA 24V; Automotive: No
SW3 SW4 = CMP-03913-99472344-1: 450404015514 Slide Switch, 0.3A, 5Vdc, Smd Rohs Compliant: Yes; Current Rating: 300mA; Insulation Resistance: 100MΩ; Voltage Rating: 5V; NexarPartId: 99472344; Min Operating Temperature: -40°C; Contact Plating: Silver; Packaging: Tape and Reel; Max Operating Temperature: 85°C; RoHS: Compliant

## Sheet Indicators.SchDoc
size A; SheetNumber: 8; SheetTotal: 8
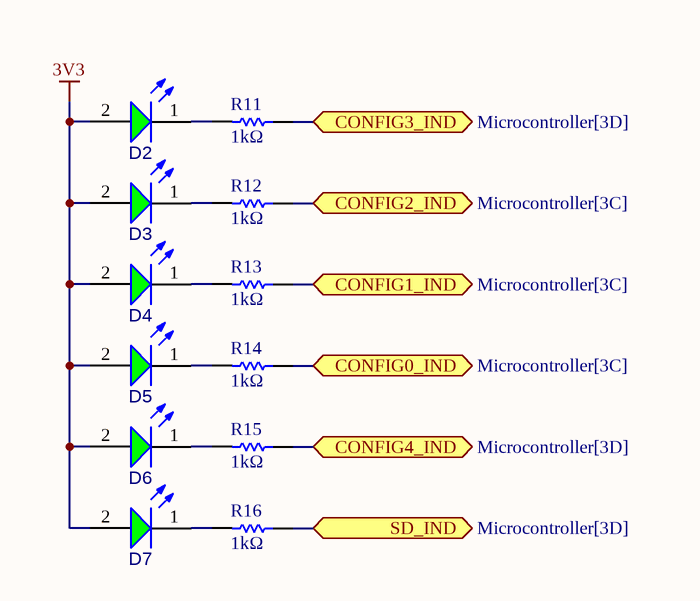
[diagram p7: Indicators.SchDoc]

### Parts
D2  150120GS75000  [WL-SMCW_1206_150120xx75000]  (value not drawn)
D3  150120GS75000  [WL-SMCW_1206_150120xx75000]  (value not drawn)
D4  150120GS75000  [WL-SMCW_1206_150120xx75000]  (value not drawn)
D5  150120GS75000  [WL-SMCW_1206_150120xx75000]  (value not drawn)
D6  150120GS75000  [WL-SMCW_1206_150120xx75000]  (value not drawn)
D7  150120GS75000  [WL-SMCW_1206_150120xx75000]  (value not drawn)
R11  1kΩ  [RESC3116X65X40LL10T20]
R12  1kΩ  [RESC3116X65X40LL10T20]
R13  1kΩ  [RESC3116X65X40LL10T20]
R14  1kΩ  [RESC3116X65X40LL10T20]
R15  1kΩ  [RESC3116X65X40LL10T20]
R16  1kΩ  [RESC3116X65X40LL10T20]

### Ports
CONFIG0_IND (bidir, see Microcontroller[3C]), CONFIG1_IND (bidir, see Microcontroller[3C]), CONFIG2_IND (bidir, see Microcontroller[3C]), CONFIG3_IND (bidir, see Microcontroller[3D]), CONFIG4_IND (bidir, see Microcontroller[3D]), SD_IND (bidir, see Microcontroller[3D])

### Nets
3V3: D2.2(A) D3.2(A) D4.2(A) D5.2(A) D6.2(A) D7.2(A)
PC0: R11.1 ; port CONFIG3_IND
PC1: R12.1 ; port CONFIG2_IND
PC2: R13.1 ; port CONFIG1_IND
PC3: R14.1 ; port CONFIG0_IND
PE0: R15.1 ; port CONFIG4_IND
PE2: R16.1 ; port SD_IND
NetD2_1: D2.1(K) R11.2
NetD3_1: D3.1(K) R12.2
NetD4_1: D4.1(K) R13.2
NetD5_1: D5.1(K) R14.2
NetD6_1: D6.1(K) R15.2
NetD7_1: D7.1(K) R16.2

### Library data of the parts
D2-D7 = CMP-1426-00014-4: as D1 on sheet Microcontroller; Case Code (Imperial): 1206; REACH SVHC: Unknown; Packaging: Tape and Reel; Max Operating Temperature: 85°C; Case/Package: 1206; Height: 680µm; Length: 3.2mm; Mount: Surface Mount; Min Operating Temperature: -40°C; Width: 1.6mm; Case Code (Metric): 3216; Max Reverse Voltage (DC): 5V; RoHS: Compliant; Wavelength: 525nm
R11-R16 = CMP-2100-03678-1: as R4 on sheet Microcontroller; Composition: ThickFilm; Min Operating Temperature: -55degC; Tolerance: 1%; REACH SVHC: Unknown; Case Code (Metric): 3216; Military Standard: Not; Datasheet Version: Rev. 5, 10/2016; Package Reference: 1206.0; Case/Package: 1206; Length: 3.1mm; Manufacturer URL: http://www.yageo.com/; Lead Free: LeadFree; RoHSCompliant: true; Termination: SMD/SMT; Packaging: TapeandReel; Package Description: 2-Pin Surface Mount Device, Body 3.1 x 1.6 mm; Depth: 1.6mm; Case Code (Imperial): 1206; Max Operating Temperature: 155degC; Datasheet URL: http://www.yageo.com/NewPortal/yageodocoutput?fileName=/pdf/R-Chip/PYu-RC_Group_51_RoHS_L_5.pdf; Height: 0.55mm

## Nets that join several sheets
3V3: Microcontroller (8 pins), Altimeter (5 pins), Accelerometer (6 pins), MicroSD (C8.2 C9.2 J1.4 R9.2), Power (C11.2 U3.2 U3.4), LevelShifter (C14.1 R10.2 U5.20), Indicators (6 pins)
5V0: Power (C10.2 C12.2 U3.3 U4.3), LevelShifter (P2.1)
GND: Microcontroller (6 pins), Altimeter (5 pins), Accelerometer (6 pins), MicroSD (8 pins), Power (7 pins), LevelShifter (9 pins), Config (6 pins)
MISO: Microcontroller (U1.16), MicroSD (R7.2), LevelShifter (P2.5)
MOSI: Microcontroller (U1.15), MicroSD (R8.2), LevelShifter (U5.2)
NetR10_1: LevelShifter (R10.1 U5.19), Config (SW4.COM)
PB6: Microcontroller (U1.7), Config (SW2.1)
PB7: Microcontroller (U1.8), Config (SW3.COM)
PC0: Microcontroller (U1.23), Indicators (R11.1)
PC1: Microcontroller (U1.24), Indicators (R12.1)
PC2: Microcontroller (U1.25), Indicators (R13.1)
PC3: Microcontroller (U1.26), Indicators (R14.1)
PD2: Microcontroller (U1.32), Config (SW2.4)
PD3: Microcontroller (U1.1), Config (SW2.3)
PD4: Microcontroller (U1.2), Config (SW2.2)
PE0: Microcontroller (U1.3), Indicators (R15.1)
PE1: Microcontroller (U1.6), MicroSD (J1.9 R9.1)
PE2: Microcontroller (U1.19), Indicators (R16.1)
PE3: Microcontroller (U1.22), MicroSD (R6.2)
RESET: Microcontroller (R1.1 SW1.1 U1.29), LevelShifter (U5.6)
SCK: Microcontroller (U1.17), MicroSD (R5.2), LevelShifter (U5.5)
SCL: Microcontroller (R2.1 U1.28), Altimeter (U2.4), Accelerometer (MT1.13)
SDA: Microcontroller (R3.1 U1.27), Altimeter (U2.3), Accelerometer (MT1.14)